# Altium schematic sheet EBS_2020.SchDoc
size A2; Organization: Altium Limited; Address1: L3, 12a Rodborough Rd; Address2: Frenchs Forest; Address3: NSW; Address4: Australia 2086
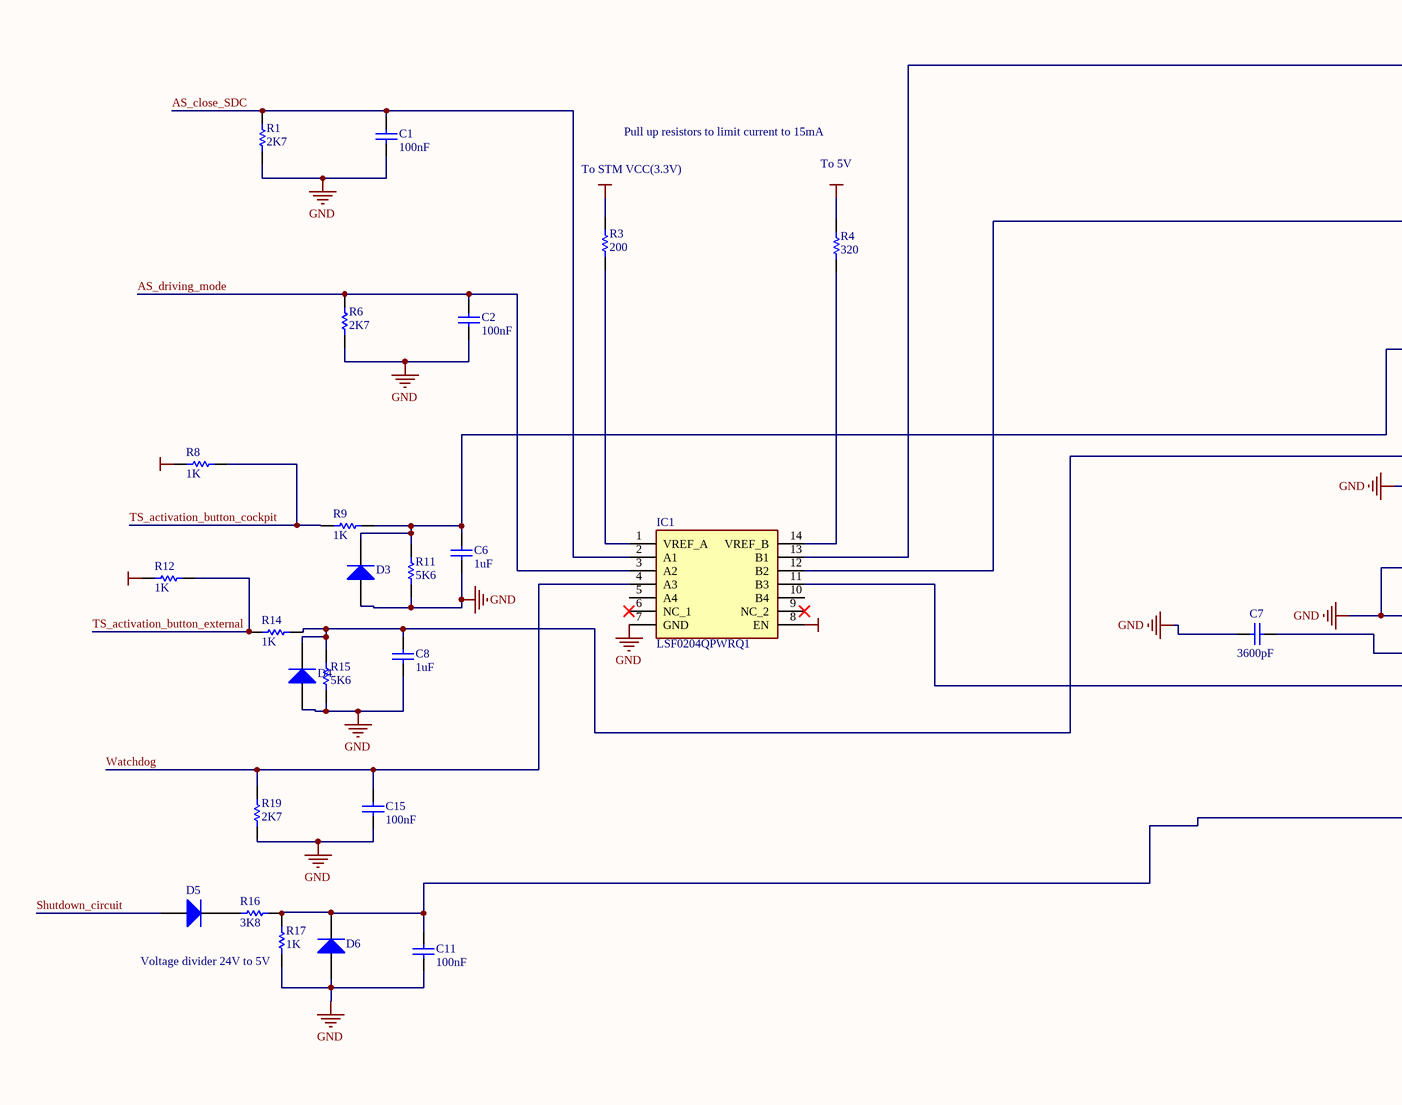
[diagram p0: EBS_2020.SchDoc, left]
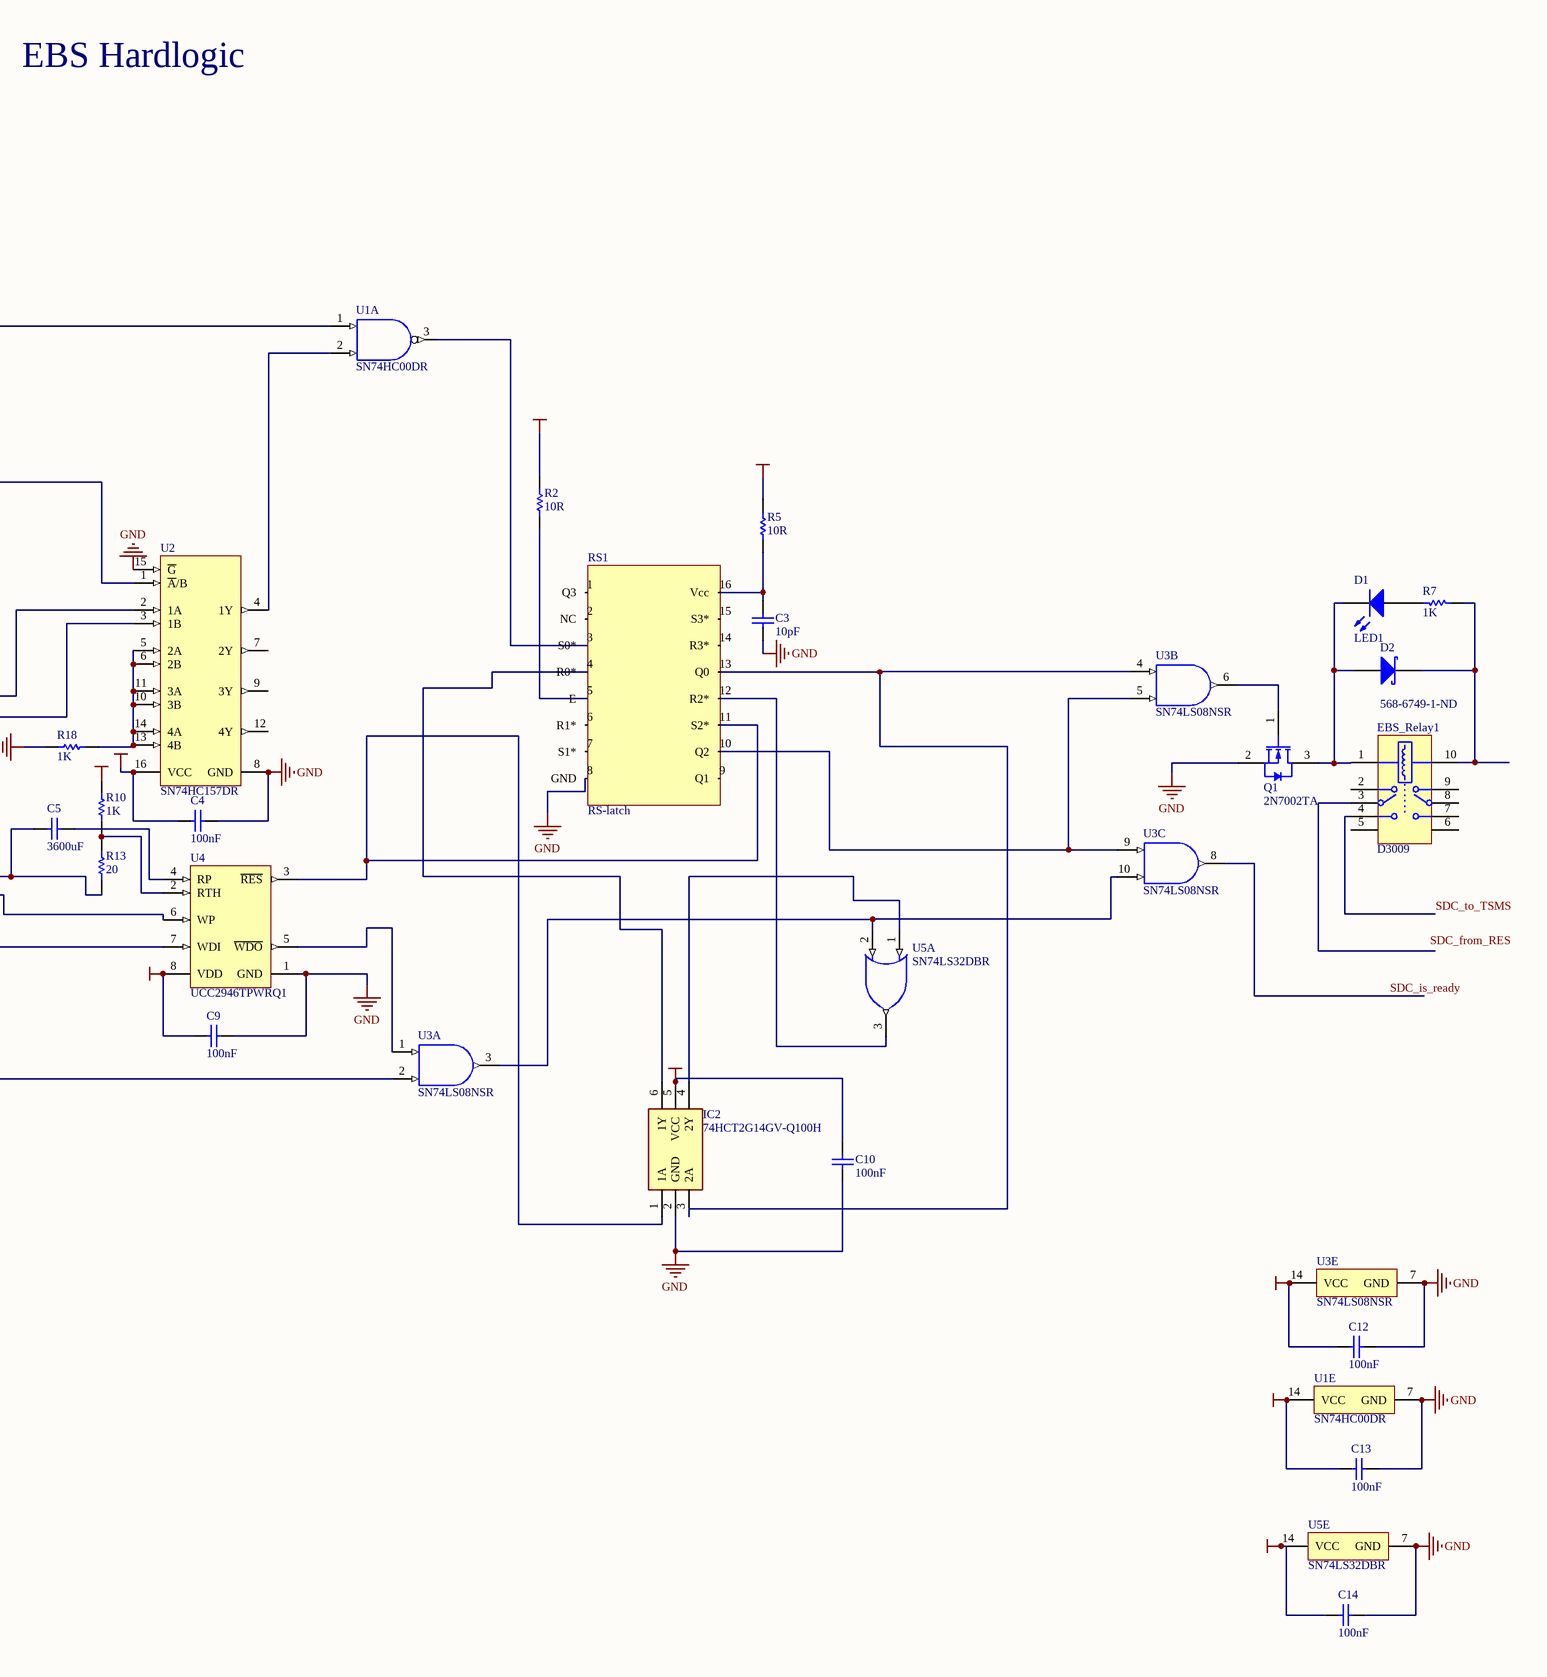
[diagram p1: EBS_2020.SchDoc, right]

## Parts
C1  100nF  [SMD-0805C]
C2  100nF  [SMD-0805C]
C3  10pF  [CAPC0805(2012)100_N]
C4  100nF  [SMD-0805C]
C5  3600uF  [SMD-0805C]
C6  1uF  [SMD-0805C]
C7  3600pF  [dV_C1206]
C8  1uF  [SMD-0805C]
C9  100nF  [SMD-0805C]
C10  100nF  [SMD-0805C]
C11  100nF  [SMD-0805C]
C12  100nF  [SMD-0805C]
C13  100nF  [SMD-0805C]
C14  100nF  [SMD-0805C]
C15  100nF  [SMD-0805C]
D1  LED1  [OSRAM_0805]
D2  Supplier Part Number 1: 568-6749-1-ND  [1SMA12AT3G]
D3  (no value)  [1SMA12AT3G]
D4  (no value)  [1SMA12AT3G]
D5  (no value)  [1SMA12AT3G]
D6  (no value)  [1SMA12AT3G]
EBS_Relay1  D3009  [TECO-FP2-10_V]
IC1  LSF0204QPWRQ1  [SOP65P640X120-14N]
IC2  74HCT2G14GV-Q100H  [SOT95P275X110-6N]
Q1  2N7002TA  [DIOD-SOT23-3_V]
R1  2K7  [SMD-0805-RES]
R2  10R  [RESC0805(2012)_N]
R3  200  [SMD-0805-RES]
R4  320  [SMD-0805-RES]
R5  10R  [RESC0805(2012)_N]
R6  2K7  [SMD-0805-RES]
R7  1K  [SMD-0805-RES]
R8  1K  [SMD-0805-RES]
R9  1K  [SMD-0805-RES]
R10  1K  [SMD-0805-RES]
R11  5K6  [SMD-0805-RES]
R12  1K  [SMD-0805-RES]
R13  20  [SMD-0805-RES]
R14  1K  [SMD-0805-RES]
R15  5K6  [SMD-0805-RES]
R16  3K8  [SMD-0805-RES]
R17  1K  [SMD-0805-RES]
R18  1K  [SMD-0805-RES]
R19  2K7  [SMD-0805-RES]
RS1  RS-latch  [SOIC127P600X175-16N]
U1  SN74HC00DR  [D0014A_M]  (parts A,E of 5)
U2  SN74HC157DR  [D0016A_M]
U3  SN74LS08NSR  [NS0014A_L]  (parts A,B,C,E of 5)
U4  UCC2946TPWRQ1  [PW8_N]
U5  SN74LS32DBR  [DB0014A_N]  (parts A,E of 5)

## Nets
GND: C1.1 C2.1 C3.1 C4.1 C5.2 C6.1 C7.2 C8.1 C9.1 C10.2 C11.1 C12.1 C13.1 C14.1 C15.1 D3.1(A) D4.1(A) D6.1(A) IC1.7(GND) IC2.2(GND) Q1.2(S) R1.1 R6.1 R11.2 R13.1 R15.2 R17.1 R18.2 R19.1 RS1.8(GND) U1.7(GND) U2.8(GND) U2.15(~{G}) U3.7(GND) U4.1(GND) U5.7(GND)
NetC4_2: C4.2 C9.2 C10.1 C12.2 C13.2 C14.2 IC1.8(EN) IC2.5(VCC) R2.2 R3.1 R4.1 R5.2 R8.2 R10.2 R12.2 U1.14(VCC) U2.16(VCC) U3.14(VCC) U4.8(VDD) U5.14(VCC)
AS_close_SDC: C1.2 IC1.2(A1) R1.2
AS_driving_mode: C2.2 IC1.3(A2) R6.2
SDC_is_ready: U3.8(3Y)
SDC_to_TSMS: EBS_Relay1.4
Shutdown_circuit: D5.1(A)
TS_activation_button_cockpit: R8.1 R9.2
TS_activation_button_external: R12.1 R14.2
Watchdog: C15.2 IC1.4(A3) R19.2
NetC3_2: C3.2 R5.1 RS1.16(Vcc)
NetC5_1: C5.1 U4.4(RP)
NetC6_2: C6.2 D3.2(K) R9.1 R11.1 U2.2(1A)
NetC7_1: C7.1 U4.6(WP)
NetC8_2: C8.2 D4.2(K) R14.1 R15.1 U2.3(1B)
NetC11_2: C11.2 D6.2(K) R16.1 R17.2 U3.2(1B)
NetD1_1: D1.1(A) R7.2
NetD1_2: D1.2(K) D2.1(A) EBS_Relay1.1 Q1.3(D)
NetD2_2: D2.2(K) EBS_Relay1.10 R7.1
NetD5_2: D5.2(K) R16.2
NetIC1_1: IC1.1(VREF_A) R3.2
NetIC1_11: IC1.11(B3) U4.7(WDI)
NetIC1_12: IC1.12(B2) U2.1(~{A}/B)
NetIC1_13: IC1.13(B1) U1.1(1A)
NetIC1_14: IC1.14(VREF_B) R4.2
NetIC2_1: IC2.1(1A) RS1.11(S2*) U4.3(~{RES})
NetIC2_3: IC2.3(2A) RS1.13(Q0) U3.4(2A)
NetIC2_4: IC2.4(2Y) U5.1(1A)
NetIC2_6: IC2.6(1Y) RS1.4(R0*)
NetQ1_1: Q1.1(G) U3.6(2Y)
NetR2_1: R2.1 RS1.5(E)
NetR10_1: R10.1 R13.2 U4.2(RTH)
NetR18_1: R18.1 U2.5(2A) U2.6(2B) U2.10(3B) U2.11(3A) U2.13(4B) U2.14(4A)
NetRS1_3: RS1.3(S0*) U1.3(1Y)
NetRS1_10: RS1.10(Q2) U3.5(2B) U3.9(3A)
NetRS1_12: RS1.12(R2*) U5.3(1Y)
NetU1_2: U1.2(1B) U2.4(1Y)
NetU3_1: U3.1(1A) U4.5(~{WDO})
NetU3_3: U3.3(1Y) U3.10(3B) U5.2(1B)

Not connected (* = marked no-connect by the designer): EBS_Relay1 2 3 5 6 7 8 9; IC1 5(A4) 6(NC_1)* 9(NC_2)* 10(B4); RS1 1(Q3) 2(NC) 6(R1*) 7(S1*) 9(Q1) 14(R3*) 15(S3*); U2 7(2Y) 9(3Y) 12(4Y)

## Notes on the sheet
- EBS Hardlogic
- (near R3) To STM VCC(3.3V)
- Pull up resistors to limit current to 15mA
- To 5V
- (near R17) Voltage divider 24V to 5V
- Labels drawn without touching a wire or pin: SDC_from_RES
- Title
- Size:
- Date:
- A3
- Number:
- Time:
- Revision:
- Sheet
- of
- File:

## Library data of the parts
C1 C2 C4-C6 C8-C15 = CMP-1036-04395-1: CAP 100nF 10V ±20% 0805 (2012 Metric) Thickness 0.75mm SMD; Case-Metric: 2012; Tolerance: Â±20%; Case-EIA: 0805; Max Thickness: 0.75 mm; Rated Voltage: 10 V; Value: 100nF; Technology: SMT
C3 = CMP-1036-00831-1: CAP 10pF 16V ±0.5pF 0805 (2012 Metric) Thickness 1mm SMD; Case-Metric: 2012; Tolerance: Â±0.5pF; Case-EIA: 0805; Max Thickness: 1 mm; Technology: SMT; Rated Voltage: 16 V; Value: 10pF
C7 = Cap: Manufacturer: KEMET; Manufacturer Part Number: C1206C362J5GACTU; Ceramic Capacitor Case: 0805 [2012 Metric]; Voltage Rating: 25; Capacitance Tolerance: ± 5%; Dielectric Characteristic: X8; Product Range: C Series; SVHC: No SVHC (15-Jun-2015)<!--FANDB--><div class="features-and-benefits-container"><div class="features-and-benefits-desc-container"><span class="features-and-benefits-container-desc">SMD Multilayer Ceramic Capacitor, 0805 [2012 Metric], 0.68 µF, 25 V, ± 5%, X8L, C Series</span></div><div class="features-and-benefits-description"><span class="features-benefits-value">The X8L dielectric features a 150°C maximum operating temperature and is considered "general purpose high temperature." These components are fixed, ceramic dielectric capacitors suited for high temperature bypass and decoupling applications or frequency discriminating circuits where Q and stability of capacitance characteristics are not critical. X8L exhibits a predictable change in capacitance with respect to time and voltage and boasts a minimal change in capacitance with reference to ambient temperature up to 125°C. Beyond 125°C X8L displays a wider variation in capacitance. Capacitance change is limited to ±15% from ?55°C to +125°C and +15, ?40% from 125°C to 150°C.</span></div><div class="features-and-benefits-list"><ul class="features-and-benefits-list-list"><li class="features-and-benefits-list-item">Operating temperature range from -55°C to 150°C</li><li class="features-and-benefits-list-item">Capacitance values ranging from 0.012µF to 10µF</li><li class="features-and-benefits-list-item">EIA 0402, 0603, 0805, 1206 and 1210 case sizes available</li><li class="features-and-benefits-list-item">DC voltage rating of 10V, 16V, 25V and 50; Temp Coeff (Dielectric): C0G; Voltage: 50VDC; Wire Form: Not Required; Case Style: Ceramic Chip; Product Length (mm): 3.2mm; Product Diameter (mm): Not Requiredmm; Product Depth (mm): 1.6mm; Tolerance (+ or -): 5%; Product Height (mm): 0.9mm; Supplier 1: Farnell; Supplier Part Number 1: 2933073; RoHS: YES; Stock 1: 576; Pricing 1: 5=0.718, 50=0.419, 250=0.279, 500=0.228, 1000=0.193, 2500=0.186, 12500=0.179 (GBP); Capacitance: 3600pF; Packaging: Tape and Reel; Operating Temperature Min: -55; Operating Temperature Max: 150; Automotive Qualification Standard: -; MSL: MSL 1 - Unlimited; ComponentLink1URL: http://www.farnell.com/datasheets/2321109.pdf; ComponentLink1Description: http://www.farnell.com/datasheets/2321109.pdf; ComponentLink2URL: https://youtu.be/PxmtxV5n2KM?list=PLa3x8V-ZYWEUNRPUyCTjknYUhI9vvDZu9; ComponentLink2Description: https://youtu.be/PxmtxV5n2KM?list=PLa3x8V-ZYWEUNRPUyCTjknYUhI9vvDZu9; ComponentLink3URL: http://www.farnell.com/datasheets/2315665.pdf; ComponentLink3Description: http://www.farnell.com/datasheets/2315665.pdf; ComponentLink4URL: http://www.farnell.com/cad/2268906.zip; ComponentLink4Description: http://www.farnell.com/cad/2268906.zip; Operating Temp Range: -55C to 125C; Supplier: Mouser; Mounting Style: Surface Mount; Supplier Part Number: 80-C1206C362J5G; Construction: SMT Chip; Package / Case: 1206; Failure Rate: Not Required
D1 = LED1: Typical RED GaAs LED; Published: 8-Jun-2000; LatestRevisionDate: 08-Jul-2005; LatestRevisionNote: Mech Layer 1 removed.; PackageReference: LED-1; Publisher: Altium Limited; PackageDescription: LED; 2 Leads
D2 = D Schottky: Schottky Diode; Manufacturer: NXP USA Inc.; Manufacturer Part Number: PMEG4030ER,115; Voltage - DC Reverse (Vr) (Max): 40V; Current - Average Rectified (Io): 3A; Voltage - Forward (Vf) (Max) @ If: 540mV @ 3A; Speed: Fast Recovery =< 500ns, > 200mA (Io); Current - Reverse Leakage @ Vr: 100µA @ 40V; Capacitance @ Vr, F: 250pF @ 1V, 1MHz; Published: 8-Jun-2000; LatestRevisionDate: 17-Jul-2002; LatestRevisionNote: Re-released for DXP Platform.; PackageReference: SMB; Publisher: Altium Limited; PackageDescription: DO-214-AA/SMB; 2 C-Bend Leads; Body 5.3 x 3.6 mm, inc. leads (LxW); Code_JEDEC: DO-214-AA; Supplier 1: Digi-Key; RoHS: RoHS Compliant; Category: Discrete Semiconductor Products; Stock 1: 38429; Pricing 1: 1=0.39, 10=0.328, 100=0.2453, 500=0.19268, 1000=0.14854 (EUR); Packaging: Cut Tape (CT); Part Status: Active; Diode Type: Schottky; Reverse Recovery Time (trr): -; Mounting Type: Surface Mount; Package / Case: SOD-123W; Supplier Device Package: SOD-123; Operating Temperature - Junction: 150°C (Max); ComponentLink1URL: http://www.nxp.com/documents/data_sheet/PMEG4030ER.pdf; ComponentLink1Description: http://www.nxp.com/documents/data_sheet/PMEG4030ER.pdf
D3-D6 = Diode 1N914: High Conductance Fast Diode; Manufacturer: PANASONIC ELECTRONIC COMPONENTS; Manufacturer Part Number: DB2W31900L; Repetitive Reverse Voltage Vrrm Max: 30; Forward Current If(AV): 3; Diode Configuration: Single; Diode Case Style: SOD-123; No. of Pins: 2; Forward Voltage VF Max: 490; Product Range: DB2W3 Series; SVHC: No SVHC (07-Jul-2017); Diode Type: Ultrafast Recovery; Reverse Recovery Time trr Max: 23; Semiconductor Technology: Si<!--FANDB--><div class="features-and-benefits-container"><div class="features-and-benefits-desc-container"><span class="features-and-benefits-container-desc">Schottky Rectifier, 30 V, 3 A, Single, SOD-123F, 2 Pins, 490 mV</span></div><div class="features-and-benefits-description"><span class="features-benefits-value">The DB2W31900L is a silicon epitaxial planar Schottky Barrier Diode suitable for rectification.</span></div><div class="features-and-benefits-list"><ul class="features-and-benefits-list-list"><li class="features-and-benefits-list-item">Low forward-voltage VF</li><li class="features-and-benefits-list-item">Low terminal capacitance Ct</li><li class="features-and-benefits-list-item">Halogen-free</li><li class="features-and-benefits-list-item">MSL 1 Compliant</li><li class="features-and-benefits-list-item">UL94V-0 Flammability rating</li></ul></div><div class="features-and-benefits-applications"><ul class="features-and-benefits-value"><li class="features-and-benefits-list-item">Industrial</li></ul></div></div>; Supplier 1: Farnell; Supplier Part Number 1: 2284956; RoHS: YES; Stock 1: 13109; Pricing 1: 5=0.428, 25=0.399, 100=0.194, 250=0.17, 500=0.136, 1000=0.115, 5000=0.101 (GBP); ComponentLink1URL: http://www.farnell.com/datasheets/1912069.pdf; ComponentLink1Description: http://www.farnell.com/datasheets/1912069.pdf; Forward Surge Current Ifsm Max: 30; Operating Temperature Max: 125; Packaging: Each; Automotive Qualification Standard: -; MSL: MSL 1 - Unlimited
EBS_Relay1 = D3009: 2 Form C, Monostable FP2 Relay, 2 A, 5 V, 10-Pin THT(FP2), RoHS, Tube; Manufacturer: TE Connectivity; Max. Coil Temperature: 125 degC; Rated Voltage: 5 V; Contact Arrangement: 2 form C (CO); Minimum Switching Voltage: 100 uV; Switching Current: 2 A; Perf. Type: Standard; Rated Coil Power: 140 mW; Thermal Resistance: <125 K/W; PartNumber: D3009; ComponentLink1Description: Manufacturer URL; ComponentLink2Description: Datasheet; Coil Type: Monostable; DatasheetVersion: Rev. 1012; ComponentLink3URL: http://www.te.com/commerce/DocumentDelivery/DDEController?Action=showdoc&DocId=Customer+Drawing%7F1462033-2%7FA5%7Fpdf%7FEnglish%7FENG_CD_1462033-2_A5_1462033-2.pdf; ComponentLink1URL: http://www.te.com/; Packing: Tube; ComponentLink2URL: http://www.te.com/commerce/DocumentDelivery/DDEController?Action=showdoc&DocId=Specification+Or+Standard%7F108-98005%7FK%7Fpdf%7FEnglish%7FENG_SS_108-98005_K.pdf; ComponentLink3Description: Package Specification; PackageVersion: Rev. A5; RoHS: TRUE; Mounting Technology: Through Hole; PackageReference: FP2-10; PackageDescription: 10-Pin FP2, Body 9 x 14 mm, Pitch 2.54 mm
IC1 = LSF0204QPWRQ1: Integrated Circuit; Manufacturer_Name: Texas Instruments; Datasheet Link: http://www.ti.com/lit/gpn/lsf0204-q1; Height: 1.2mm; Mouser2 Part Number: 595-LSF0204QPWRQ1; Mouser2 Price/Stock: https://www.mouser.com/Search/Refine.aspx?Keyword=595-LSF0204QPWRQ1; Manufacturer_Part_Number: LSF0204QPWRQ1
IC2 = 74HCT2G14GV-Q100H: Integrated Circuit; Manufacturer_Name: Nexperia; Datasheet Link: https://assets.nexperia.com/documents/data-sheet/74HC_HCT2G14_Q100.pdf; Height: 1.1mm; Manufacturer_Part_Number: 74HCT2G14GV-Q100H
Q1 = CMP-2000-05566-1: N-Channel Enhancement Mode Field Effect Transistor, 60 V, 0.3 W, -55 to 150 degC, 3-Pin SOT23, Pb-Free, Tape and Reel; Manufacturer: DiodesIncorporated; Transistor Type: 1N-Channel; Typical Turn-Off Delay Time: 11ns; Vds - Drain-Source Breakdown Voltage: 60V; Pd - Power Dissipation: 330mW; Id - Continuous Drain Current: 115mA; Rds On - Drain-Source Resistance: 7.5Ohms; Number of Channels: 1Channel; Vgs - Gate-Source Voltage: 40V; Type: FET; Configuration: Single; Unit Weight: 0.000282oz; Typical Turn-On Delay Time: 7ns; Factory Pack Quantity: 3000; Series: 2N7002; Package Description: 3-Pin Small Outline Transistor, Body 2.9 x 1.3 mm, Pitch 0.96 mm; Datasheet URL: https://datasheet.ciiva.com/15137/getdatasheetpartid-85857-15137606.pdf; Packaging: Reel; &lt;PCN&gt;: http://www.mouser.com/PCN/Diodes_Inc_2165.pdf; Package / Case: SOT-23-3; Mounting Style: SMD/SMT; Brand: DiodesIncorporated; Maximum Operating Temperature: +150C; Technology: Si; Datasheet Version: Rev. 24-2, 11/2010; Package Reference: SOT23-3; Channel Mode: Enhancement; Mounting Technology: SurfaceMount; Transistor Polarity: N-Channel; Product Category: MOSFET; RoHS: True; Width: 1.3mm; Height: 1mm; Product: MOSFETSmallSignal; Length: 2.9mm; Manufacturer URL: http://www.diodes.com/; Minimum Operating Temperature: -55C
R1 R3 R4 R6 R8-R19 = CMP-1013-00557-1: 2K7 0.125W 1% 0805 (2012 Metric)  SMD; Case-EIA: 0805; Value: 2700.00 Ohm; Case-Metric: 2012; Tolerance: 1 %; Power: 0.125 W; Technology: SMT
R2 R5 = CMP-1013-00284-1: 10R 0.125W 1% 0805 (2012 Metric)  SMD; Case-Metric: 2012; Value: 10.00 Ohm; Case-EIA: 0805; Tolerance: 1 %; Technology: SMT; Power: 0.125 W
R7 = CMP-1013-00510-1: 1K 0.125W 1% 0805 (2012 Metric)  SMD; Case-Metric: 2012; Value: 1000.00 Ohm; Case-EIA: 0805; Tolerance: 1 %; Power: 0.125 W; Technology: SMT
RS1 = RS-latch: MC14044B
U1 = CMP-1622-00008-2: Quad 2-Input Positive-NAND Gates, D0014A, LARGE T&R; Manufacturer: Texas Instruments; VCC(Max)(V): 6; Technology Family: HC; Schmitt Trigger: Yes; ICC @ Nom Voltage(Max)(mA): 0.02; F @ Nom Voltage(Max)(Mhz): 70; Bits(#): 4; Input Type: CMOS; Output Drive (IOL/IOH)(Max)(mA): 5.2/-5.2; Voltage(Nom)(V): 5; VCC(Min)(V): 2; Rating: Catalog; tpd @ Nom Voltage(Max)(ns): 23; Generic Part Number: SN74HC00; Code_JEDEC: MS-012; PackageReference: D0014A; DatasheetVersion: SCLS181E; Operating Temperature Range(C): -40 to 85; Output Type: CMOS
U2 = CMP-1628-00003-2: Quadruple 2-Line To 1-Line Data Selectors/Multiplexers, D0016A, LARGE T&R; Manufacturer: Texas Instruments; Voltage(Nom)(V): 3.3,5; Configuration: 2：1; Rating: Catalog; ICC @ Nom Voltage(Max)(mA): 10; Input Type: LVTTL/CMOS; Function: Encoder/Multiplexer; Technology Family: HC; tpd @ Nom Voltage(Max)(ns): 32; Output Type: CMOS; Channels(#): 4; VCC(Min)(V): 2; VCC(Max)(V): 6; Output Drive (IOL/IOH)(Max)(mA): 7.8/-7.8; F @ Nom Voltage(Max)(Mhz): 28; Schmitt Trigger: No; DatasheetVersion: SCLS113D; PackageReference: D0016A; Generic Part Number: SN74HC157; Operating Temperature Range(C): -40 to 85; Code_JEDEC: MS-012 variation AC; Type: Standard; Bits(#): 2
U3 = CMP-0777-00305-4: Quadruple 2-Input Positive-AND Gates, NS0014A, LARGE T&R; Manufacturer: Texas Instruments; Output Type: TTL; ICC @ Nom Voltage(Max)(mA): 0.021; VCC(Max)(V): 5.25; Output Drive (IOL/IOH)(Max)(mA): -0.8/16; Technology Family: LS; Voltage(Nom)(V): 5; tpd @ Nom Voltage(Max)(ns): 25; Bits(#): 4; Schmitt Trigger: No; VCC(Min)(V): 4.75; F @ Nom Voltage(Max)(Mhz): 35; Rating: Catalog; Operating Temperature Range(C): 0 to 70; PackageReference: NS0014A; Input Type: TTL; DatasheetVersion: SDLS033; Generic Part Number: SN74LS08
U4 = UCC2946TPWRQ1: Automotive Catalog Microprocessor Supervisor with Watchdog Timer, 1 Supply Monitored, -40 to 105 degC, 8-pin TSSOP (PW), Green (RoHS & no Sb/Br); Manufacturer: Texas Instruments; # of supplies monitored: 1; Iq(Typ)(uA): 12; Output Driver Type / Reset Output: Active-low, Push-pull; Reset Threshold Accuracy(%): 2; SubFamily: Supervisor and Reset IC; Threshold Voltage 1 (typ)(Typ)(V): 1.235; Time Delay(ms): Programmable; VCC(Max)(V): 5.5; VCC(Min)(V): 2.1; DatasheetVersion: SGLS273B; PackageVersion: revG, Feb-2011; PackageReference: PW8; PackageDescription: 8-Pin Plastic Thin Small Outline Package 3 x 4.4 mm Body ,0.65 mm Pitch; Supplier 1: Digi-Key; Supplier Part Number 1: 296-23028-2-ND; Supplier 2: Digi-Key; Supplier Part Number 2: 296-23028-1-ND; Supplier 3: Digi-Key; Supplier Part Number 3: 296-23028-6-ND; Supplier 4: Newark; Supplier Part Number 4: 73J8423; Supplier 5: Mouser; Supplier Part Number 5: 595-UCC2946TPWRQ1; Rating: Automotive; Watchdog Timer WDI(sec): Programmable; Mounting Technology: Surface Mount; Code_JEDEC: MO-153; PartNumber: UCC2946TPWRQ1; ComponentLink1Description: Datasheet; ComponentLink1URL: http://www.ti.com/general/docs/lit/getliterature.tsp?genericPartNumber=UCC2946-Q1&fileType=pdf
U5 = CMP-1573-00077-3: Quad 2-input positive-OR gates, DB0014A, LARGE T&R; Manufacturer: Texas Instruments; F @ Nom Voltage(Max)(Mhz): 35; Voltage(Nom)(V): 5; Bits(#): 4; VCC(Max)(V): 5.25; Output Type: TTL; VCC(Min)(V): 4.75; ICC @ Nom Voltage(Max)(mA): 0.038; Output Drive (IOL/IOH)(Max)(mA): 0.8/-16; tpd @ Nom Voltage(Max)(ns): 22; Rating: Catalog; PackageReference: DB0014A; Operating Temperature Range(C): 0 to 70; DatasheetVersion: SDLS100; PackageVersion: http://www.ti.com/lit/ml/msso002e/msso002e.pdf; Generic Part Number: SN74LS32; Code_JEDEC: MO-150; Input Type: TTL